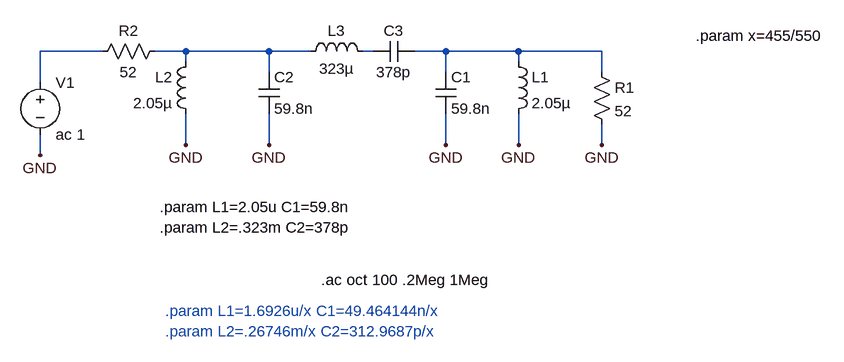
[diagram p0: schematic IFfilter.asc]
IFfilter.asc, the LTspice schematic file:
Version 4
SHEET 1 3232 1452
WIRE 2224 1152 2224 1104
WIRE 2224 1024 2224 1008
WIRE 2224 1008 2352 1008
WIRE 2496 1008 2512 1008
WIRE 2576 1008 2624 1008
WIRE 2736 1008 2736 1024
WIRE 2736 1104 2736 1152
WIRE 2352 1152 2352 1104
WIRE 2352 1040 2352 1008
WIRE 2352 1008 2416 1008
WIRE 2624 1008 2624 1040
WIRE 2624 1104 2624 1152
WIRE 2624 1008 2736 1008
WIRE 2736 1008 2864 1008
WIRE 2864 1008 2864 1040
WIRE 2864 1120 2864 1152
WIRE 2224 1008 2176 1008
WIRE 2096 1008 2000 1008
WIRE 2000 1008 2000 1056
WIRE 2000 1136 2000 1168
FLAG 2736 1152 GND
FLAG 2624 1152 GND
FLAG 2352 1152 GND
FLAG 2224 1152 GND
FLAG 2864 1152 GND
FLAG 2000 1168 GND
SYMBOL ind 2720 1008 R0
SYMATTR InstName L1
SYMATTR Value 2.05µ
SYMBOL cap 2608 1040 R0
SYMATTR InstName C1
SYMATTR Value 59.8n
SYMBOL cap 2336 1040 R0
SYMATTR InstName C2
SYMATTR Value 59.8n
SYMBOL ind 2240 1008 M0
SYMATTR InstName L2
SYMATTR Value 2.05µ
SYMBOL ind 2400 1024 R270
WINDOW 0 32 56 VTop 0
WINDOW 3 5 56 VBottom 0
SYMATTR InstName L3
SYMATTR Value 323µ
SYMBOL cap 2576 992 R90
WINDOW 0 0 32 VBottom 0
WINDOW 3 32 32 VTop 0
SYMATTR InstName C3
SYMATTR Value 378p
SYMBOL res 2848 1024 R0
SYMATTR InstName R1
SYMATTR Value 52
SYMBOL res 2192 992 R90
WINDOW 0 0 56 VBottom 0
WINDOW 3 32 56 VTop 0
SYMATTR InstName R2
SYMATTR Value 52
SYMBOL voltage 2000 1040 R0
SYMATTR InstName V1
SYMATTR Value ac 1
text 2184 1248 Left 0 !.param L1=2.05u C1=59.8n\n.param L2=.323m C2=378p
text 2432 1360 Left 0 !.ac oct 100 .2Meg 1Meg
text 3008 984 Left 0 !.param x=455/550
text 2192 1408 Left 0 ;.param L1=1.6926u/x C1=49.464144n/x\n.param L2=.26746m/x C2=312.9687p/x

The netlist it stands for:
* IFfilter.asc
L1 N003 GND 2.05µ
C1 N003 GND 59.8n
C2 N001 GND 59.8n
L2 N001 GND 2.05µ
L3 N001 N002 323µ
C3 N003 N002 378p
R1 N003 GND 52
R2 N001 N004 52
V1 N004 GND ac 1
.param L1=2.05u C1=59.8n
.param L2=.323m C2=378p
.ac oct 100 .2Meg 1Meg
.param x=455/550
* .param L1=1.6926u/x C1=49.464144n/x
* .param L2=.26746m/x C2=312.9687p/x
.backanno
.end